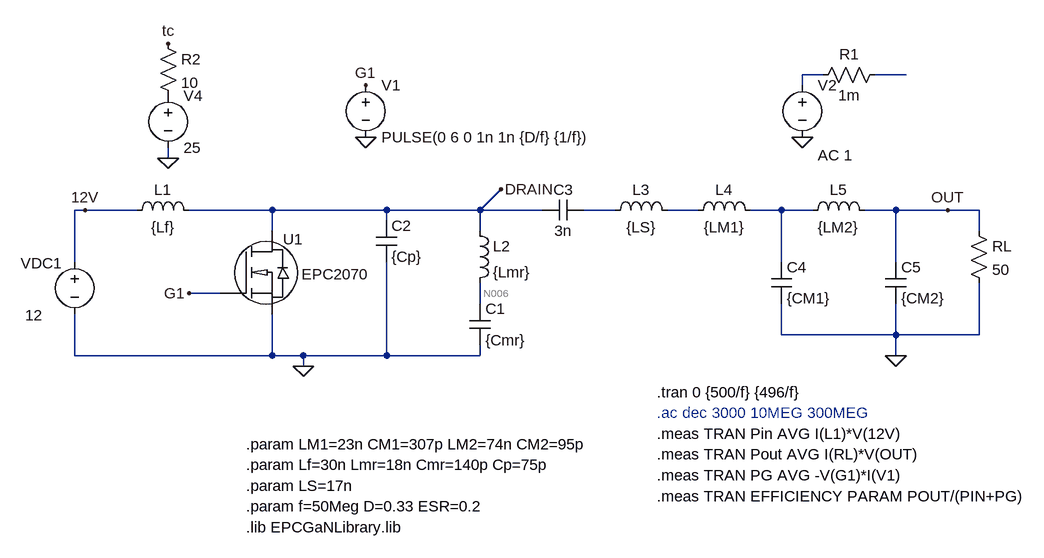
[diagram p0: schematic phi_2_50MHz_EPC2070.asc]
phi_2_50MHz_EPC2070.asc, the LTspice schematic file:
Version 4
SHEET 1 1068 680
WIRE 448 -192 416 -192
WIRE 576 -192 528 -192
WIRE 416 -176 416 -192
WIRE -560 -64 -560 -80
WIRE -688 16 -704 16
WIRE -608 16 -688 16
WIRE -400 16 -528 16
WIRE -224 16 -400 16
WIRE -80 16 -48 -16
WIRE -80 16 -224 16
WIRE 16 16 -80 16
WIRE 128 16 80 16
WIRE 256 16 208 16
WIRE 384 16 336 16
WIRE 432 16 384 16
WIRE 560 16 512 16
WIRE 640 16 560 16
WIRE 688 16 640 16
WIRE -224 32 -224 16
WIRE -400 48 -400 16
WIRE -80 48 -80 16
WIRE 688 48 688 16
WIRE -704 96 -704 16
WIRE 384 96 384 16
WIRE 560 96 560 16
WIRE -480 144 -528 144
WIRE -80 160 -80 128
WIRE 384 208 384 160
WIRE 560 208 560 160
WIRE 560 208 384 208
WIRE 688 208 688 128
WIRE 688 208 560 208
WIRE -704 240 -704 176
WIRE -400 240 -400 176
WIRE -400 240 -704 240
WIRE -352 240 -400 240
WIRE -224 240 -224 96
WIRE -224 240 -352 240
WIRE -80 240 -80 224
WIRE -80 240 -224 240
WIRE 560 240 560 208
WIRE -352 256 -352 240
FLAG -688 16 12V
FLAG -256 -176 G1
FLAG -256 -96 0
FLAG 640 16 OUT
FLAG 416 -96 0
FLAG 560 240 0
FLAG -48 -16 DRAIN
FLAG -352 256 0
FLAG -528 144 G1
FLAG -560 -64 0
FLAG -560 -240 tc
SYMBOL voltage -704 80 R0
WINDOW 123 0 0 Left 0
WINDOW 39 0 0 Left 0
WINDOW 0 -83 18 Left 2
WINDOW 3 -76 98 Left 2
SYMATTR InstName VDC1
SYMATTR Value 12
SYMBOL cap -96 224 M180
WINDOW 0 24 56 Left 2
WINDOW 3 24 8 Left 2
SYMATTR InstName C1
SYMATTR Value {Cmr}
SYMBOL ind -624 32 R270
WINDOW 0 32 56 VTop 2
WINDOW 3 5 56 VBottom 2
SYMATTR InstName L1
SYMATTR Value {Lf}
SYMATTR SpiceLine Rser={ESR}
SYMBOL ind -96 32 R0
SYMATTR InstName L2
SYMATTR Value {Lmr}
SYMATTR SpiceLine Rser={ESR}
SYMBOL cap -240 32 R0
SYMATTR InstName C2
SYMATTR Value {Cp}
SYMBOL voltage -256 -192 R0
WINDOW 123 0 0 Left 0
WINDOW 39 0 0 Left 0
SYMATTR InstName V1
SYMATTR Value PULSE(0 6 0 1n 1n {D/f} {1/f})
SYMBOL res 672 32 R0
SYMATTR InstName RL
SYMATTR Value 50
SYMBOL ind 112 32 R270
WINDOW 0 32 56 VTop 2
WINDOW 3 5 56 VBottom 2
SYMATTR InstName L3
SYMATTR Value {LS}
SYMATTR SpiceLine Rser={ESR}
SYMBOL voltage 416 -192 R0
WINDOW 123 24 124 Left 2
WINDOW 39 0 0 Left 0
SYMATTR Value2 AC 1
SYMATTR InstName V2
SYMATTR Value ""
SYMBOL cap 80 0 R90
WINDOW 0 0 32 VBottom 2
WINDOW 3 32 32 VTop 2
SYMATTR InstName C3
SYMATTR Value 3n
SYMBOL ind 240 32 R270
WINDOW 0 32 56 VTop 2
WINDOW 3 5 56 VBottom 2
SYMATTR InstName L4
SYMATTR Value {LM1}
SYMBOL cap 368 96 R0
SYMATTR InstName C4
SYMATTR Value {CM1}
SYMBOL ind 416 32 R270
WINDOW 0 32 56 VTop 2
WINDOW 3 5 56 VBottom 2
SYMATTR InstName L5
SYMATTR Value {LM2}
SYMATTR SpiceLine Rser={ESR}
SYMBOL cap 544 96 R0
SYMATTR InstName C5
SYMATTR Value {CM2}
SYMBOL res 432 -176 R270
WINDOW 0 32 56 VTop 2
WINDOW 3 0 56 VBottom 2
SYMATTR InstName R1
SYMATTR Value 1m
SYMBOL voltage -560 -176 R0
SYMATTR InstName V4
SYMATTR Value 25
SYMBOL res -576 -256 R0
SYMATTR InstName R2
SYMATTR Value 10
SYMBOL EPCGaN -480 144 R0
WINDOW 0 97 -83 Left 2
WINDOW 3 125 -29 Left 2
SYMATTR InstName U1
SYMATTR Value EPC2070
TEXT -440 472 Left 2 !.param f=50Meg D=0.33 ESR=0.2
TEXT -440 440 Left 2 !.param LS=17n
TEXT 192 296 Left 2 !.tran 0 {500/f} {496/f}
TEXT -440 504 Left 2 !.lib EPCGaNLibrary.lib
TEXT -440 408 Left 2 !.param Lf=30n Lmr=18n Cmr=140p Cp=75p
TEXT 192 328 Left 2 ;.ac dec 3000 10MEG 300MEG
TEXT -440 376 Left 2 !.param LM1=23n CM1=307p LM2=74n CM2=95p
TEXT 192 360 Left 2 !.meas TRAN Pin AVG I(L1)*V(12V)
TEXT 192 392 Left 2 !.meas TRAN Pout AVG I(RL)*V(OUT)
TEXT 192 424 Left 2 !.meas TRAN PG AVG -V(G1)*I(V1)
TEXT 192 456 Left 2 !.meas TRAN EFFICIENCY PARAM POUT/(PIN+PG)

The netlist it stands for:
* phi_2_50MHz_EPC2070.asc
VDC1 12V 0 12
C1 0 N006 {Cmr}
L1 12V DRAIN {Lf} Rser={ESR}
L2 DRAIN N006 {Lmr} Rser={ESR}
C2 DRAIN 0 {Cp}
V1 G1 0 PULSE(0 6 0 1n 1n {D/f} {1/f})
RL OUT 0 50
L3 N003 N004 {LS} Rser={ESR}
V2 N001 0 AC 1
C3 N003 DRAIN 3n
L4 N004 N005 {LM1}
C4 N005 0 {CM1}
L5 N005 OUT {LM2} Rser={ESR}
C5 OUT 0 {CM2}
R1 N001 N002 1m
V4 P001 0 25
R2 tc P001 10
XU1 G1 DRAIN 0 EPC2070  ; pins gatein drainin N_0
.param f=50Meg D=0.33 ESR=0.2
.param LS=17n
.tran 0 {500/f} {496/f}
.lib EPCGaNLibrary.lib
.param Lf=30n Lmr=18n Cmr=140p Cp=75p
* .ac dec 3000 10MEG 300MEG
.param LM1=23n CM1=307p LM2=74n CM2=95p
.meas TRAN Pin AVG I(L1)*V(12V)
.meas TRAN Pout AVG I(RL)*V(OUT)
.meas TRAN PG AVG -V(G1)*I(V1)
.meas TRAN EFFICIENCY PARAM POUT/(PIN+PG)
.lib EPCGanlibrary.lib
.backanno
.end

* Results of the author's LTspice run, read from the files saved beside the schematic
* Operating Point, zero values left out:
*   V(12v) = 12 V
*   V(n006) = 12 V
*   V(drain) = 12 V
*   V(p001) = 25 V
*   V(tc) = 25 V
*   I(L1) = 66.17 nA
*   I(V1) = 38.74 nA
*   I(Vdc1) = -66.17 nA
*   Ix(u1:GATEIN) = -38.74 nA
*   Ix(u1:DRAININ) = 66.17 nA
*   Ix(u1:SOURCEIN) = -27.44 nA
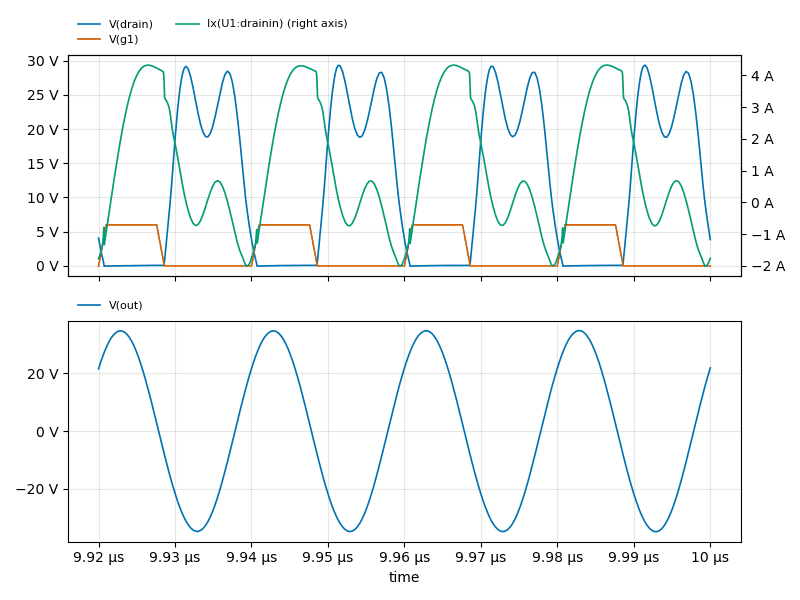
[diagram p1: Transient Analysis of phi_2_50MHz_EPC2070.asc, plotted from the saved traces]
* Transient Analysis, 1 run:
*   V(drain): min -28.8 mV, max 29.34 V, average 11.75 V, rms 16.44 V, last 3.85 V
*   V(g1): min 0 V, max 6 V, average 2.28 V, rms 3.617 V, last 0 V
*   Ix(U1:drainin): min -2.005 A, max 4.327 A, average 1.138 A, rms 2.35 A, last -1.759 A
*   V(out): min -34.78 V, max 34.76 V, average 4.972 mV, rms 24.53 V, last 21.86 V
* From the log:
*   pin: AVG(i(l1)*v(12v))=13.6848 FROM 0 TO 8e-008
*   pout: AVG(i(rl)*v(out))=12.0224 FROM 0 TO 8e-008
*   pg: AVG(-v(g1)*i(v1))=0.331328 FROM 0 TO 8e-008
*   efficiency: pout/(pin+pg)=0.857754